# Altium schematic sheet [06] - USB.SchDoc: IMXBB
size A3; DocumentNumber: 6; Revision: 2.0; SheetNumber: 6; SheetTotal: 13
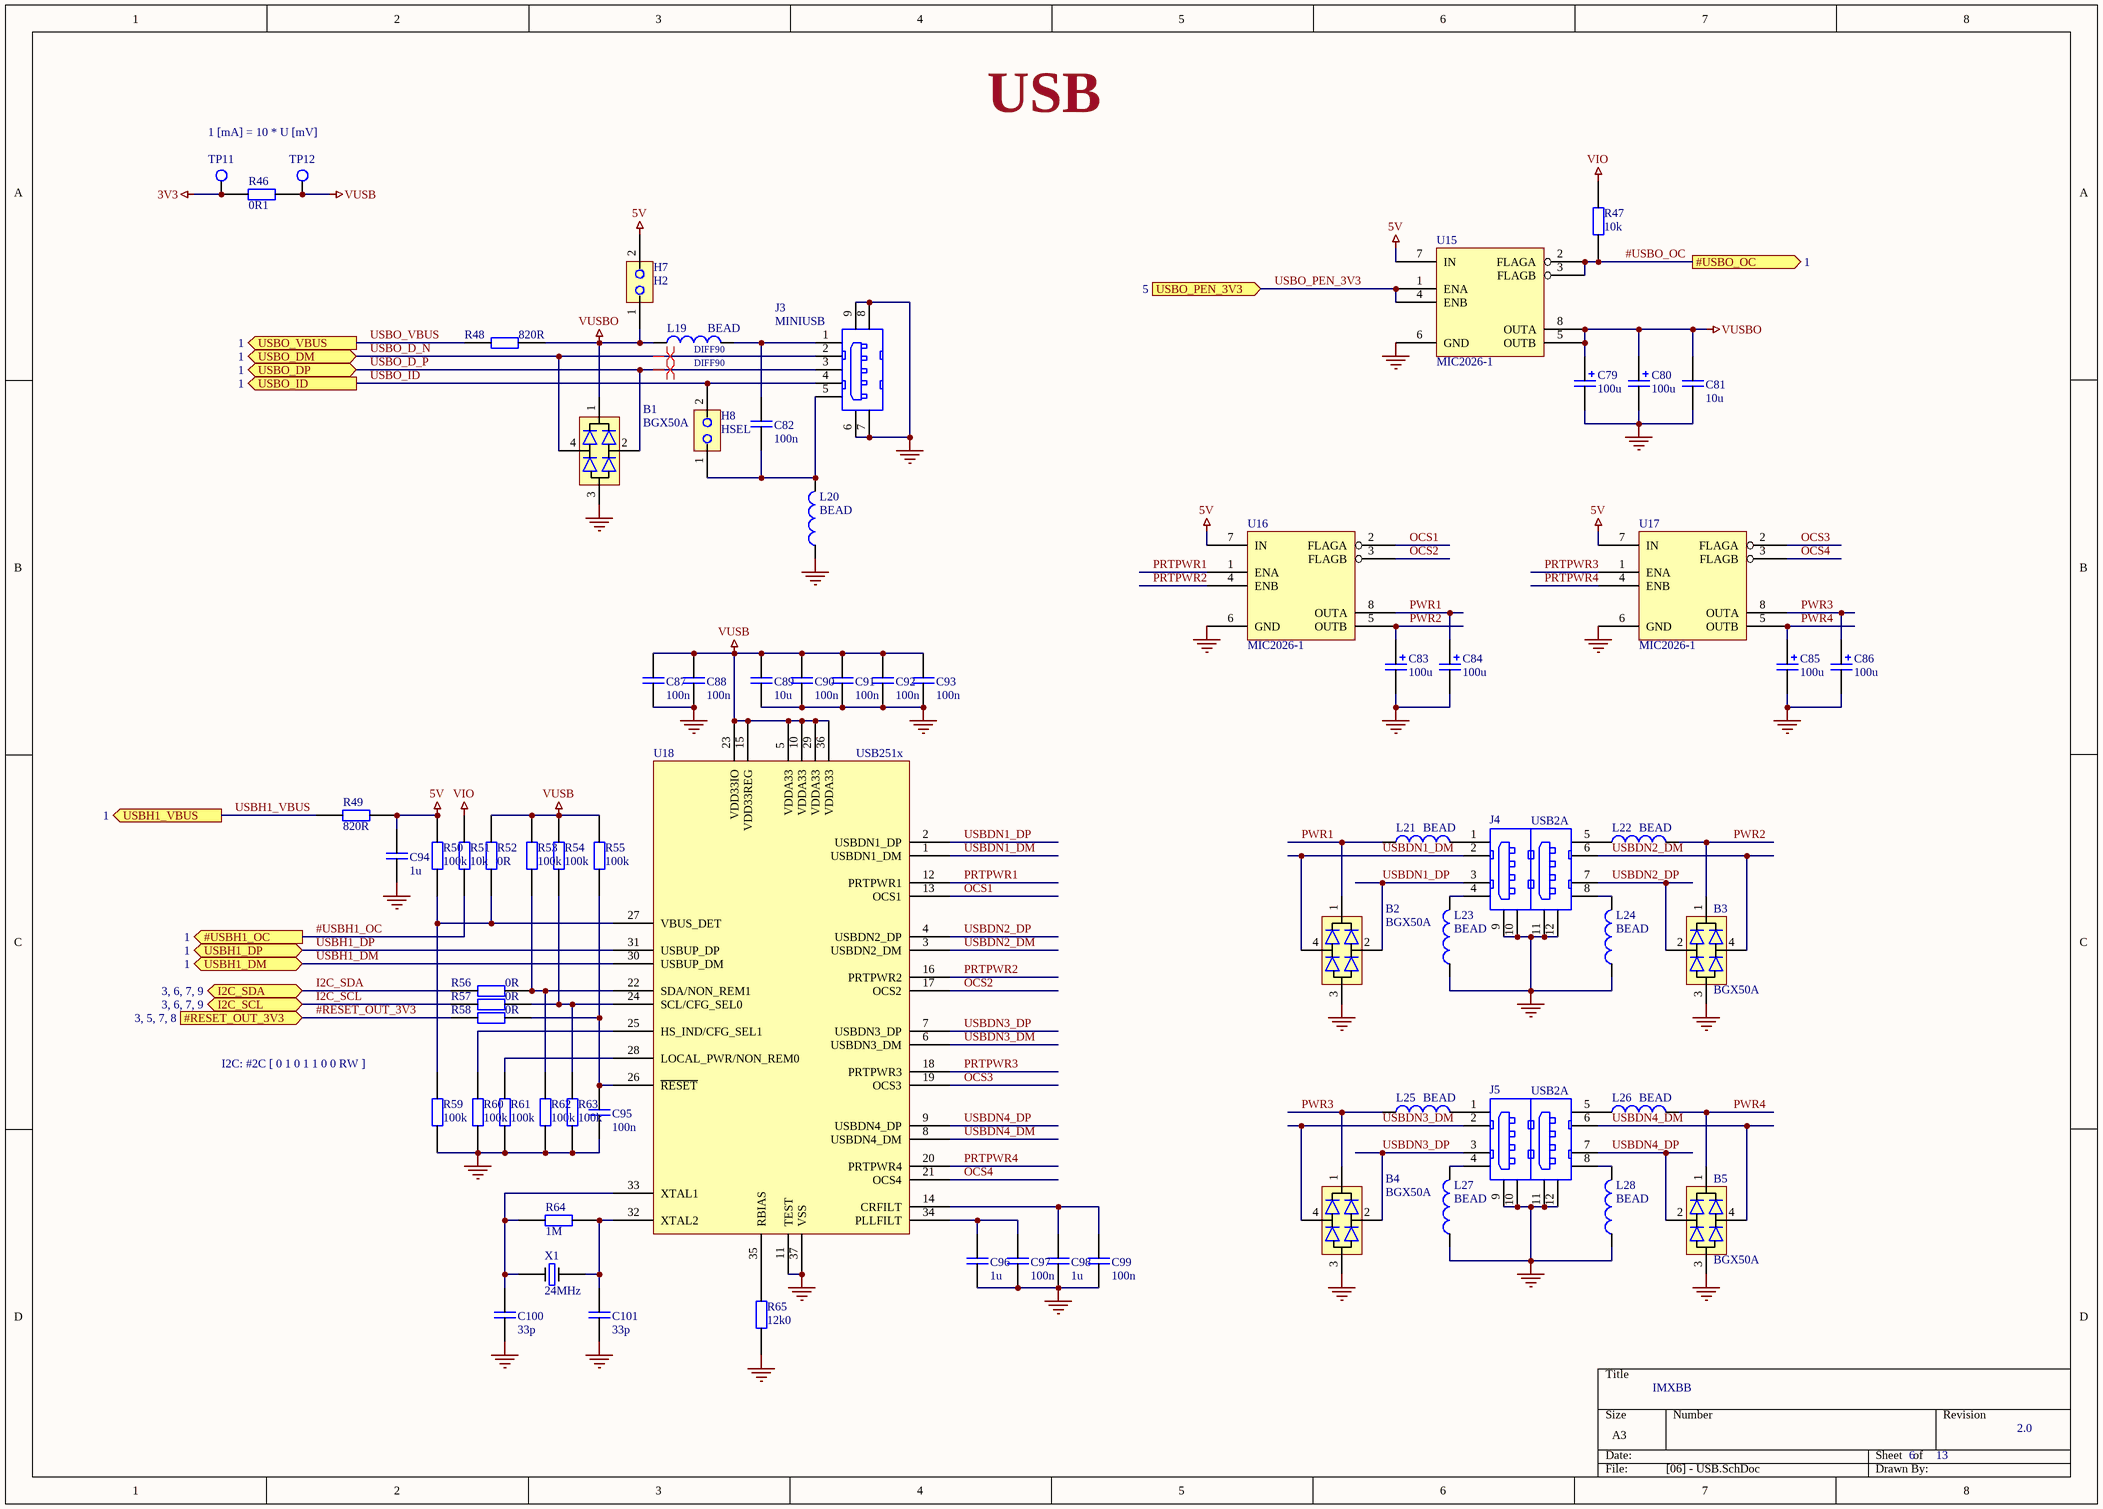
[diagram p0: [06] - USB.SchDoc]

## Parts
B1  BGX50A  [SOT143]
B2  BGX50A  [SOT143]
B3  BGX50A  [SOT143]
B4  BGX50A  [SOT143]
B5  BGX50A  [SOT143]
C79  100u  [CTANTALD]
C80  100u  [CTANTALD]
C81  10u  [0805]
C82  100n  [0603]
C83  100u  [CTANTALD]
C84  100u  [CTANTALD]
C85  100u  [CTANTALD]
C86  100u  [CTANTALD]
C87  100n  [0603]
C88  100n  [0603]
C89  10u  [0805]
C90  100n  [0603]
C91  100n  [0603]
C92  100n  [0603]
C93  100n  [0603]
C94  1u  [0603]
C95  100n  [0603]
C96  1u  [0603]
C97  100n  [0603]
C98  1u  [0603]
C99  100n  [0603]
C100  33p  [0603]
C101  33p  [0603]
H7  H2  [H1x2]
H8  HSEL  [H1x2]
J3  MINIUSB  [MINI_USB_AB]
J4  USB2A  [USB-2A]
J5  USB2A  [USB-2A]
L19  BEAD  [0603]
L20  BEAD  [0603]
L21  BEAD  [0603]
L22  BEAD  [0603]
L23  BEAD  [0603]
L24  BEAD  [0603]
L25  BEAD  [0603]
L26  BEAD  [0603]
L27  BEAD  [0603]
L28  BEAD  [0603]
R46  0R1  [0603]
R47  10k  [0603]
R48  820R  [0603]
R49  820R  [0603]
R50  100k  [0603]
R51  10k  [0603]
R52  0R  [0603]
R53  100k  [0603]
R54  100k  [0603]
R55  100k  [0603]
R56  0R  [0603]
R57  0R  [0603]
R58  0R  [0603]
R59  100k  [0603]
R60  100k  [0603]
R61  100k  [0603]
R62  100k  [0603]
R63  100k  [0603]
R64  1M  [0603]
R65  12k0  [0603]
TP11  TESTPOINT  [TESTPOINT_2mm]  (value not drawn)
TP12  TESTPOINT  [TESTPOINT_2mm]  (value not drawn)
U15  MIC2026-1  [SOIC8N]
U16  MIC2026-1  [SOIC8N]
U17  MIC2026-1  [SOIC8N]
U18  USB251x  [QFN36]
X1  24MHz  [HC494H]

## Ports
#RESET_OUT_3V3 (in, see 3, 5, 7, 8), #USBH1_OC (out, see 1), #USBO_OC (out, see 1), I2C_SCL (bidir, see 3, 6, 7, 9), I2C_SDA (bidir, see 3, 6, 7, 9), USBH1_DM (bidir, see 1), USBH1_DP (bidir, see 1), USBH1_VBUS (out, see 1), USBO_DM (bidir, see 1), USBO_DP (bidir, see 1), USBO_ID (out, see 1), USBO_PEN_3V3 (in, see 5), USBO_VBUS (out, see 1)

## Nets
3V3: R46.1 TP11.1
5V: C94.2 H7.2 R49.1 R50.2 U15.7(IN) U16.7(IN) U17.7(IN)
GND: B1.3 B2.3 B3.3 B4.3 B5.3 C79.2 C80.2 C81.1 C83.2 C84.2 C85.2 C86.2 C87.1 C88.1 C89.1 C90.1 C91.1 C92.1 C93.1 C94.1 C95.1 C96.1 C97.1 C98.1 C99.1 C100.1 C101.1 J3.6(SHIELD) J3.7(SHIELD) J3.8(SHIELD) J3.9(SHIELD) J4.9(SHIELD) J4.10(SHIELD) J4.11(SHIELD) J4.12(SHIELD) J5.9(SHIELD) J5.10(SHIELD) J5.11(SHIELD) J5.12(SHIELD) L20.1 L23.1 L24.1 L27.1 L28.1 R59.2 R60.2 R61.2 R62.2 R63.2 R65.1 U15.6(GND) U16.6(GND) U17.6(GND) U18.11(TEST) U18.37(VSS)
VIO: R47.1 R51.1
VUSB: C87.2 C88.2 C89.2 C90.2 C91.2 C92.2 C93.2 R46.2 R52.2 R53.1 R54.1 R55.1 TP12.1 U18.5(VDDA33) U18.10(VDDA33) U18.15(VDD33REG) U18.23(VDD33IO) U18.29(VDDA33) U18.36(VDDA33)
VUSBO: B1.1 C79.1 C80.1 C81.2 H7.1 L19.1 R48.1 U15.5(OUTB) U15.8(OUTA)
#RESET_OUT_3V3: R58.2 ; port #RESET_OUT_3V3
#USBH1_OC: R51.2 ; port #USBH1_OC
#USBO_OC: R47.2 U15.2(FLAGA) U15.3(FLAGB) ; port #USBO_OC
I2C_SCL: R57.2 ; port I2C_SCL
I2C_SDA: R56.2 ; port I2C_SDA
OCS1: U16.2(FLAGA) U18.13(OCS1)
OCS2: U16.3(FLAGB) U18.17(OCS2)
OCS3: U17.2(FLAGA) U18.19(OCS3)
OCS4: U17.3(FLAGB) U18.21(OCS4)
PRTPWR1: U16.1(ENA) U18.12(PRTPWR1)
PRTPWR2: U16.4(ENB) U18.16(PRTPWR2)
PRTPWR3: U17.1(ENA) U18.18(PRTPWR3)
PRTPWR4: U17.4(ENB) U18.20(PRTPWR4)
PWR1: B2.1 C84.1 L21.1 U16.8(OUTA)
PWR2: B3.1 C83.1 L22.2 U16.5(OUTB)
PWR3: B4.1 C86.1 L25.1 U17.8(OUTA)
PWR4: B5.1 C85.1 L26.2 U17.5(OUTB)
USBDN1_DM: B2.4 J4.2(D-) U18.1(USBDN1_DM)
USBDN1_DP: B2.2 J4.3(D+) U18.2(USBDN1_DP)
USBDN2_DM: B3.4 J4.6(D2-) U18.3(USBDN2_DM)
USBDN2_DP: B3.2 J4.7(D2+) U18.4(USBDN2_DP)
USBDN3_DM: B4.4 J5.2(D-) U18.6(USBDN3_DM)
USBDN3_DP: B4.2 J5.3(D+) U18.7(USBDN3_DP)
USBDN4_DM: B5.4 J5.6(D2-) U18.8(USBDN4_DM)
USBDN4_DP: B5.2 J5.7(D2+) U18.9(USBDN4_DP)
USBH1_DM: U18.30(USBUP_DM) ; port USBH1_DM
USBH1_DP: U18.31(USBUP_DP) ; port USBH1_DP
USBH1_VBUS: R49.2 ; port USBH1_VBUS
USBO_D_N: B1.4 J3.2(D-) ; port USBO_DM
USBO_D_P: B1.2 J3.3(D+) ; port USBO_DP
USBO_ID: H8.2 J3.4(ID) ; port USBO_ID
USBO_PEN_3V3: U15.1(ENA) U15.4(ENB) ; port USBO_PEN_3V3
USBO_VBUS: R48.2 ; port USBO_VBUS
NetC82_1: C82.1 H8.1 J3.5(GND) L20.2
NetC82_2: C82.2 J3.1(VBUS) L19.2
NetC95_2: C95.2 R55.2 R58.1 U18.26(~{RESET})
NetC96_2: C96.2 C97.2 U18.34(PLLFILT)
NetC98_2: C98.2 C99.2 U18.14(CRFILT)
NetC100_2: C100.2 R64.2 U18.33(XTAL1) X1.1
NetC101_2: C101.2 R64.1 U18.32(XTAL2) X1.2
NetJ4_1: J4.1(VBUS) L21.2
NetJ4_4: J4.4(GND) L23.2
NetJ4_5: J4.5(VBUS2) L22.1
NetJ4_8: J4.8(GND) L24.2
NetJ5_1: J5.1(VBUS) L25.2
NetJ5_4: J5.4(GND) L27.2
NetJ5_5: J5.5(VBUS2) L26.1
NetJ5_8: J5.8(GND) L28.2
NetR50_1: R50.1 R52.1 R59.1 U18.27(VBUS_DET)
NetR53_2: R53.2 R56.1 R62.1 U18.22(SDA/NON_REM1)
NetR54_2: R54.2 R57.1 R63.1 U18.24(SCL/CFG_SEL0)
NetR60_1: R60.1 U18.25(HS_IND/CFG_SEL1)
NetR61_1: R61.1 U18.28(LOCAL_PWR/NON_REM0)
NetR65_2: R65.2 U18.35(RBIAS)

## Layout directives
differential pair; net class DIFF90: USBO_D_N, USBO_D_P

## Notes on the sheet
- 1 [mA] = 10 * U [mV]
- USB
- (near R59) I2C: #2C [ 0 1 0 1 1 0 0 RW ]

## Library data of the parts
C79 C80 C83-C86 = C+
C81 C82 C87-C101 = C
H8 = H2
L19-L28 = FBEAD
R46-R65 = R
TP11 TP12 = TESTPOINT: Testpoint pad; Order number: no component; Component class: TP; Producer: n/a; Assembly type: no component
U15-U17 = MIC2026
X1 = XTAL